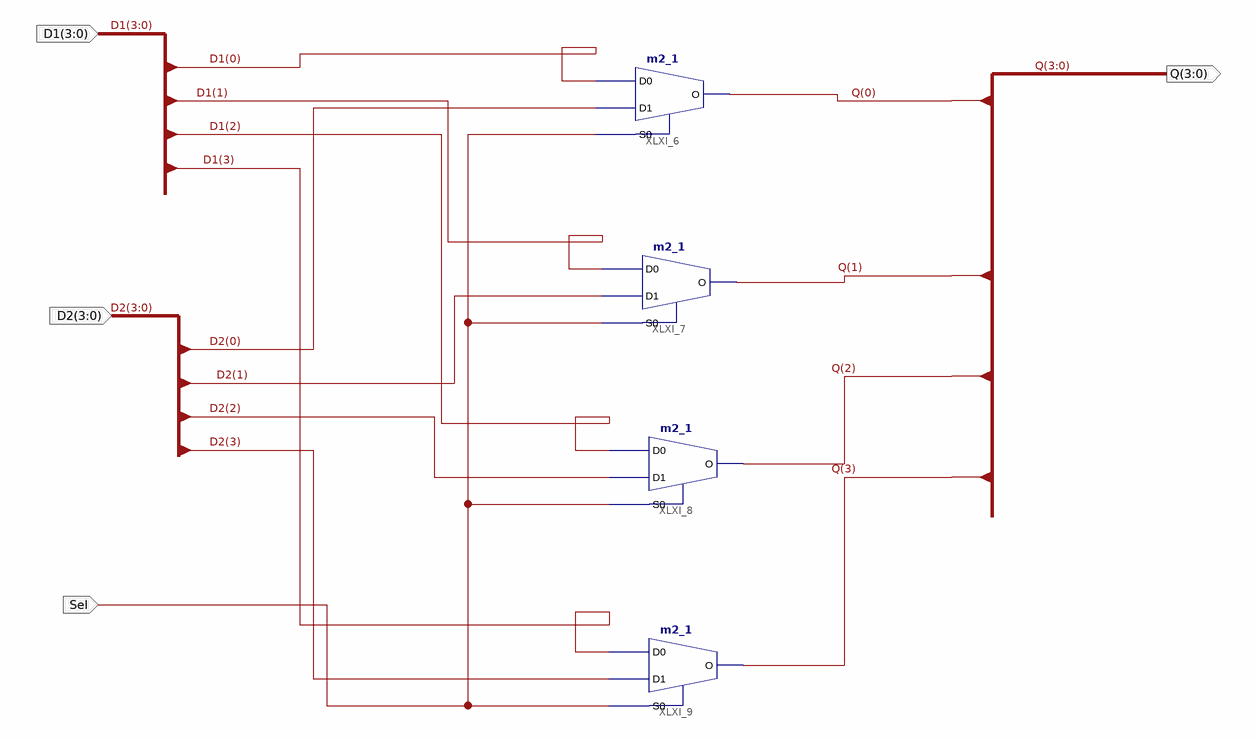
[diagram p0: schematic sheet 1]
// Xilinx ISE schematic Mux2_1_4.sch (spartan6) as structural Verilog: 4 symbols, 4 ports
module Mux2_1_4 (
  input  [3:0] D1,
  input  [3:0] D2,
  input  Sel,
  output [3:0] Q
);

  m2_1 XLXI_6 (.D0(D1[0]), .D1(D2[0]), .S0(Sel), .O(Q[0]));
  m2_1 XLXI_7 (.D0(D1[1]), .D1(D2[1]), .S0(Sel), .O(Q[1]));
  m2_1 XLXI_8 (.D0(D1[2]), .D1(D2[2]), .S0(Sel), .O(Q[2]));
  m2_1 XLXI_9 (.D0(D1[3]), .D1(D2[3]), .S0(Sel), .O(Q[3]));
endmodule
